# Altium schematic sheet WL-CPU.SchDoc
size 420 x 297 mm; Scale: 1:1; DocumentType: Схема электрическая принципиальная; FirstReferrence: UA3REO/R7KBI; SheetNumber: 2; SheetTotal: 12
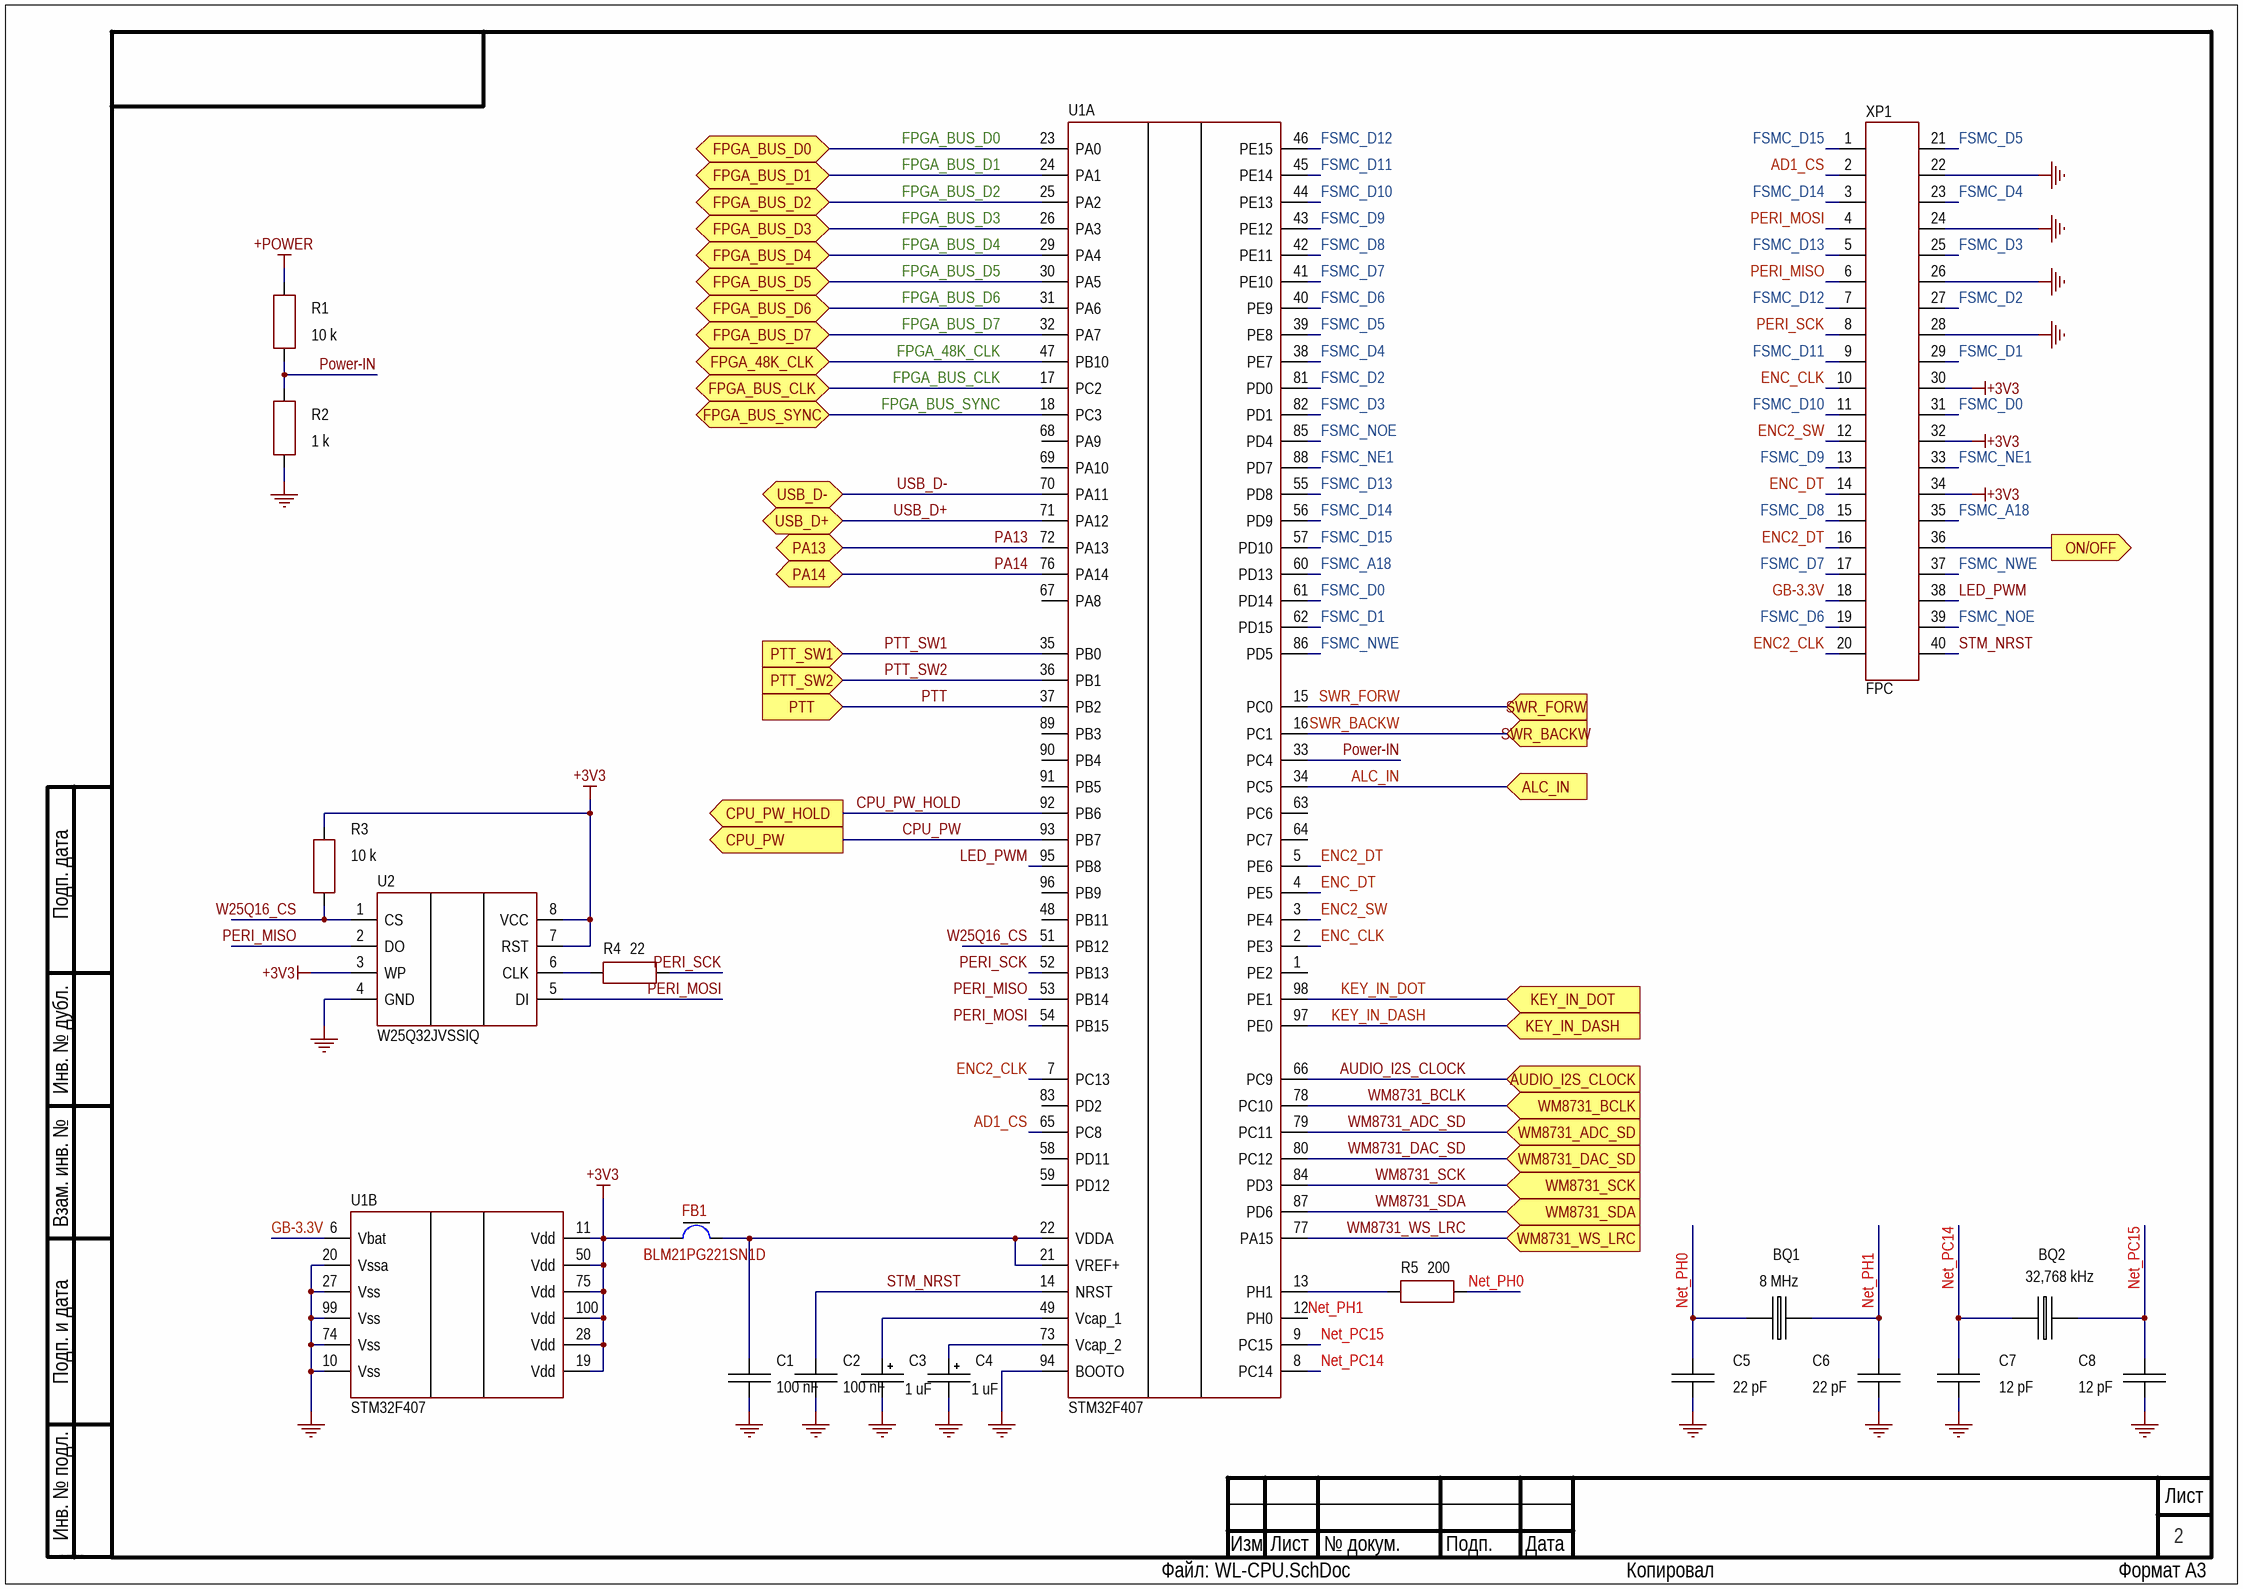
[diagram p0: WL-CPU.SchDoc]

## Parts
BQ1  8 MHz  [SMD-4-CRYSTAL]
BQ2  32,768 kHz  [SOJ-4]
C1  100 nF  [C-0805-0.95]
C2  100 nF  [C-0805-0.95]
C3  1 uF  [CAP-CASE B]
C4  1 uF  [CAP-CASE B]
C5  22 pF  [C-0805-0.7]
C6  22 pF  [C-0805-0.7]
C7  12 pF  [C-0805-0.7]
C8  12 pF  [C-0805-0.7]
FB1  BLM21PG221SN1D  [L-0805]
R1  10 k  [R-0805]
R2  1 k  [R-0805]
R3  10 k  [R-0805]
R4  22  [R-0805]
R5  200  [R-0805]
U1  STM32F407  [LQFP-100]  (parts A,B of 2)
U2  W25Q32JVSSIQ  [SOIC-8-W]
XP1  FPC  [FPC-40-05-V]

## Ports
ALC_IN (in), AUDIO_I2S_CLOCK (in), CPU_PW (out), CPU_PW_HOLD (out), FPGA_48K_CLK (bidir), FPGA_BUS_CLK (bidir), FPGA_BUS_D0 (bidir), FPGA_BUS_D1 (bidir), FPGA_BUS_D2 (bidir), FPGA_BUS_D3 (bidir), FPGA_BUS_D4 (bidir), FPGA_BUS_D5 (bidir), FPGA_BUS_D6 (bidir), FPGA_BUS_D7 (bidir), FPGA_BUS_SYNC (bidir), KEY_IN_DASH (in), KEY_IN_DOT (in), ON/OFF (out), PA13 (bidir), PA14 (bidir), PTT (in), PTT_SW1 (in), PTT_SW2 (in), SWR_BACKW (in), SWR_FORW (in), USB_D+ (bidir), USB_D- (bidir), WM8731_ADC_SD (in), WM8731_BCLK (in), WM8731_DAC_SD (in), WM8731_SCK (in), WM8731_SDA (in), WM8731_WS_LRC (in)

## Nets
+3V3: FB1.2 R3.2 U1.11(Vdd) U1.19(Vdd) U1.28(Vdd) U1.50(Vdd) U1.75(Vdd) U1.100(Vdd) U2.3(WP) U2.7(RST) U2.8(VCC) XP1.30 XP1.32 XP1.34
+POWER: R1.2
GND: C1.2 C2.1 C3.2 C4.2 C5.1 C6.1 C7.1 C8.1 R2.1 U1.10(Vss) U1.20(Vssa) U1.27(Vss) U1.74(Vss) U1.94(BOOTO) U1.99(Vss) U2.4(GND) XP1.22 XP1.24 XP1.26 XP1.28
AD1_CS: U1.65(PC8) XP1.2
ALC_IN: U1.34(PC5) ; port ALC_IN
AUDIO_I2S_CLOCK: U1.66(PC9) ; port AUDIO_I2S_CLOCK
CPU_PW: U1.93(PB7) ; port CPU_PW
CPU_PW_HOLD: U1.92(PB6) ; port CPU_PW_HOLD
ENC2_CLK: U1.7(PC13) XP1.20
ENC2_DT: U1.5(PE6) XP1.16
ENC2_SW: U1.3(PE4) XP1.12
ENC_CLK: U1.2(PE3) XP1.10
ENC_DT: U1.4(PE5) XP1.14
FPGA_48K_CLK: U1.47(PB10) ; port FPGA_48K_CLK
FPGA_BUS_CLK: U1.17(PC2) ; port FPGA_BUS_CLK
FPGA_BUS_D0: U1.23(PA0) ; port FPGA_BUS_D0
FPGA_BUS_D1: U1.24(PA1) ; port FPGA_BUS_D1
FPGA_BUS_D2: U1.25(PA2) ; port FPGA_BUS_D2
FPGA_BUS_D3: U1.26(PA3) ; port FPGA_BUS_D3
FPGA_BUS_D4: U1.29(PA4) ; port FPGA_BUS_D4
FPGA_BUS_D5: U1.30(PA5) ; port FPGA_BUS_D5
FPGA_BUS_D6: U1.31(PA6) ; port FPGA_BUS_D6
FPGA_BUS_D7: U1.32(PA7) ; port FPGA_BUS_D7
FPGA_BUS_SYNC: U1.18(PC3) ; port FPGA_BUS_SYNC
FSMC_A18: U1.60(PD13) XP1.35
FSMC_D0: U1.61(PD14) XP1.31
FSMC_D1: U1.62(PD15) XP1.29
FSMC_D2: U1.81(PD0) XP1.27
FSMC_D3: U1.82(PD1) XP1.25
FSMC_D4: U1.38(PE7) XP1.23
FSMC_D5: U1.39(PE8) XP1.21
FSMC_D6: U1.40(PE9) XP1.19
FSMC_D7: U1.41(PE10) XP1.17
FSMC_D8: U1.42(PE11) XP1.15
FSMC_D9: U1.43(PE12) XP1.13
FSMC_D10: U1.44(PE13) XP1.11
FSMC_D11: U1.45(PE14) XP1.9
FSMC_D12: U1.46(PE15) XP1.7
FSMC_D13: U1.55(PD8) XP1.5
FSMC_D14: U1.56(PD9) XP1.3
FSMC_D15: U1.57(PD10) XP1.1
FSMC_NE1: U1.88(PD7) XP1.33
FSMC_NOE: U1.85(PD4) XP1.39
FSMC_NWE: U1.86(PD5) XP1.37
GB-3.3V: U1.6(Vbat) XP1.18
KEY_IN_DASH: U1.97(PE0) ; port KEY_IN_DASH
KEY_IN_DOT: U1.98(PE1) ; port KEY_IN_DOT
LED_PWM: U1.95(PB8) XP1.38
Net_PC14: BQ2.1 C7.2 U1.8(PC14)
Net_PC15: BQ2.4 C8.2 U1.9(PC15)
Net_PH0: BQ1.1 C5.2 R5.1
Net_PH1: BQ1.4 C6.2 U1.12(PH0)
ON/OFF: XP1.36 ; port ON/OFF
PA13: U1.72(PA13) ; port PA13
PA14: U1.76(PA14) ; port PA14
PERI_MISO: U1.53(PB14) U2.2(DO) XP1.6
PERI_MOSI: U1.54(PB15) U2.5(DI) XP1.4
PERI_SCK: R4.2 U1.52(PB13) XP1.8
Power-IN: R1.1 R2.2 U1.33(PC4)
PTT: U1.37(PB2) ; port PTT
PTT_SW1: U1.35(PB0) ; port PTT_SW1
PTT_SW2: U1.36(PB1) ; port PTT_SW2
STM_NRST: C2.2 U1.14(NRST) XP1.40
SWR_BACKW: U1.16(PC1) ; port SWR_BACKW
SWR_FORW: U1.15(PC0) ; port SWR_FORW
USB_D+: U1.71(PA12) ; port USB_D+
USB_D-: U1.70(PA11) ; port USB_D-
W25Q16_CS: R3.1 U1.51(PB12) U2.1(CS)
WM8731_ADC_SD: U1.79(PC11) ; port WM8731_ADC_SD
WM8731_BCLK: U1.78(PC10) ; port WM8731_BCLK
WM8731_DAC_SD: U1.80(PC12) ; port WM8731_DAC_SD
WM8731_SCK: U1.84(PD3) ; port WM8731_SCK
WM8731_SDA: U1.87(PD6) ; port WM8731_SDA
WM8731_WS_LRC: U1.77(PA15) ; port WM8731_WS_LRC
NetC1_1: C1.1 FB1.1 U1.21(VREF+) U1.22(VDDA)
NetC3_1: C3.1 U1.49(Vcap_1)
NetC4_1: C4.1 U1.73(Vcap_2)
NetR4_1: R4.1 U2.6(CLK)
NetR5_2: R5.2 U1.13(PH1)

Not connected (* = marked no-connect by the designer): U1 1(PE2) 48(PB11) 58(PD11) 59(PD12) 63(PC6) 64(PC7) 67(PA8) 68(PA9) 69(PA10) 83(PD2) 89(PB3) 90(PB4) 91(PB5) 96(PB9)

## Notes on the sheet
- Подп. дата
- Инв. № дубл.
- Взам. инв. №
- Подп. и дата
- Инв. № подл.
- Изм.
- Лист
- № докум.
- Подп.
- Дата
- ALTIUM GOSTBOM2.0 KEV
- Файл:
- Копировал
- Формат А3

## Library data of the parts
BQ1 = ABM3B-8.000MHZ-B2-T: Manufacturer: Abracon LLC; Type: Кварцевый резонатор; Part Number: ABM3B-8.000MHZ-B2-T; Value: 8 MHz; Case: SMD-4-CRYSTAL; Operating Temperature: −20°C ... 70°C
BQ2 = ABS25-32.768KHZ-T: Manufacturer: Abracon LLC; Type: Кварцевый резонатор; Part Number: ABS25-32.768KHZ-T; Value: 32,768 kHz; Case: SOJ-4; Operating Temperature: −40°C ... 85°C
C1 C2 = CC0805KRX7R9BB104: Manufacturer: Yageo; Value: 100; Type: Конденсатор; Dielectric: X7R; Tolerance: ±10%; Voltage: 50 V; CommentDOC: ( CC - 0805 - X7R - 50 V - 100 nF ±10% ); Part Number: CC0805KRX7R9BB104; Units: nF; Case: 0805; Operating Temperature: -55 ... 125 °C; Series: CC; Value+Units: 100 nF; ValueSCH: 100 nF; ( Series - Case - Dielectric -  Voltage - Value+Units Tolerance: ( CC - 0805 - X7R - 50 V - 100 nF ±10% )
C3 C4 = EEE-1HA010SR: Manufacturer: Panasonic Electronic Components; Type: Конденсатор; Value: 1; Tolerance: ±20%; Voltage: 50 V; CommentDOC: ( S - 50 V - 1  uF  ±20% ); Part Number: EEE-1HA010SR; Units: uF; Case: 4x5.4; Operating Temperature: -40 ... 85 °C; Series: S; ValueSCH: 1 uF; ( Series - Voltage - Value  Units  Tolerance ): ( S - 50 V - 1  uF  ±20% )
C5 C6 = CC0805JRNPO9BN220: Manufacturer: Yageo; Value: 22; Type: Конденсатор; Dielectric: NPO; Tolerance: ±5%; Voltage: 50 V; CommentDOC: ( CC - 0805 - NPO - 50 V - 22 pF ±5% ); Part Number: CC0805JRNPO9BN220; Units: pF; Case: 0805; Operating Temperature: -55 ... 125 °C; Series: CC; Value+Units: 22 pF; ValueSCH: 22 pF; ( Series - Case - Dielectric -  Voltage - Value+Units Tolerance: ( CC - 0805 - NPO - 50 V - 22 pF ±5% )
C7 C8 = CC0805JRNPO9BN120: Manufacturer: Yageo; Value: 12; Type: Конденсатор; Dielectric: NPO; Tolerance: ±5%; Voltage: 50 V; CommentDOC: ( CC - 0805 - NPO - 50 V - 12 pF ±5% ); Part Number: CC0805JRNPO9BN120; Units: pF; Case: 0805; Operating Temperature: -55 ... 125 °C; Series: CC; Value+Units: 12 pF; ValueSCH: 12 pF; ( Series - Case - Dielectric -  Voltage - Value+Units Tolerance: ( CC - 0805 - NPO - 50 V - 12 pF ±5% )
FB1 = BLM21PG221SN1D: Manufacturer: Murata Electronics; Type: Ферритовая бусина; Part Number: BLM21PG221SN1D; Series: EMIFIL; Case: 0805; ValueSCH: BLM21PG221SN1D; Operating Temperature: −55°C ... 125°C
R1 R3 = RC0805JR-0710KL: Manufacturer: Yageo; Value: 10; Power: 0,125 W; Units: kOhm; Tolerance: ±5%; Operating Voltage: 150 V; Value+Units: 10 kOhm; CommentDOC: ( RC - 0805 - 0,125 W - 10 kOhm  ±5% ); Type: Резистор; Part Number: RC0805JR-0710KL; Case: 0805; Operating Temperature: -55°C ... 155°C; ValueSCH: 10 k; Series: RC
R2 = RC0805JR-071KL: Manufacturer: Yageo; Value: 1; Power: 0,125 W; Units: kOhm; Tolerance: ±5%; Operating Voltage: 150 V; Value+Units: 1 kOhm; CommentDOC: ( RC - 0805 - 0,125 W - 1 kOhm  ±5% ); Type: Резистор; Part Number: RC0805JR-071KL; Case: 0805; Operating Temperature: -55°C ... 155°C; ValueSCH: 1 k; Series: RC
R4 = RC0805JR-0722RL: Manufacturer: Yageo; Power: 0,125 W; Units: Ohm; Tolerance: ±5%; Operating Voltage: 150 V; Value+Units: 22 Ohm; CommentDOC: ( RC - 0805 - 0,125 W - 22 Ohm  ±5% ); Value: 22; Type: Резистор; Part Number: RC0805JR-0722RL; Case: 0805; Operating Temperature: -55°C ... 155°C; ValueSCH: 22; Series: RC
R5 = RC0805JR-07200RL: Manufacturer: Yageo; Power: 0,125 W; Units: Ohm; Tolerance: ±5%; Operating Voltage: 150 V; Value+Units: 200 Ohm; CommentDOC: ( RC - 0805 - 0,125 W - 200 Ohm  ±5% ); Value: 200; Type: Резистор; Part Number: RC0805JR-07200RL; Case: 0805; Operating Temperature: -55°C ... 155°C; ValueSCH: 200; Series: RC
U1 = STM32F407VGT6: Manufacturer: STMicroelectronics; Operation Frequency: 168 MHz; Prog Interface: SWD; Part Number: STM32F407VGT6; Case: LQFP-100; Operating Temperature: -40°С ... 85°С; Type: Микроконтроллер
U2 = W25Q32JVSSIQ: IC FLASH 32MBIT SPI/QUAD; Manufacturer: Winbond Electronics; ValueSCH: W25Q32; Voltage  Supply: +2,7 V … 3,6 V; Part Number: W25Q32JVSSIQ; Function: IC FLASH 32MBIT SPI/QUAD; Case: SOIC-8-W; Operating Temperature: -40°С ... 85°С; Type: Микросхема
XP1 = AFC11-S40ICC-00: Manufacturer: JUSHUO; Type: Вилка; Part Number: AFC11-S40ICC-00